# Altium schematic sheet base.SchDoc: base
size 495 x 337 mm; Date: 2019/11/11 19:09:25; SheetNumber: 1; GateName_1: G$2; SymbolName_1: DOCFIELD; LibraryName: frames; DeviceSetName: DINA3_L; Sheet: Sheet:; REV: REV:
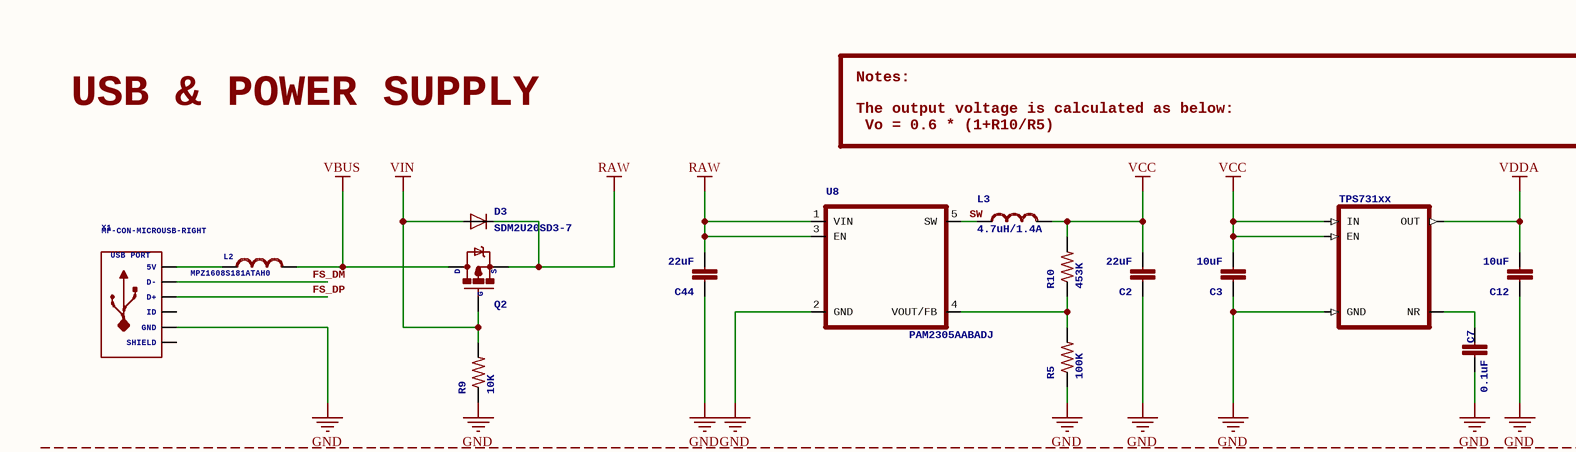
[diagram p0: base.SchDoc, top left]
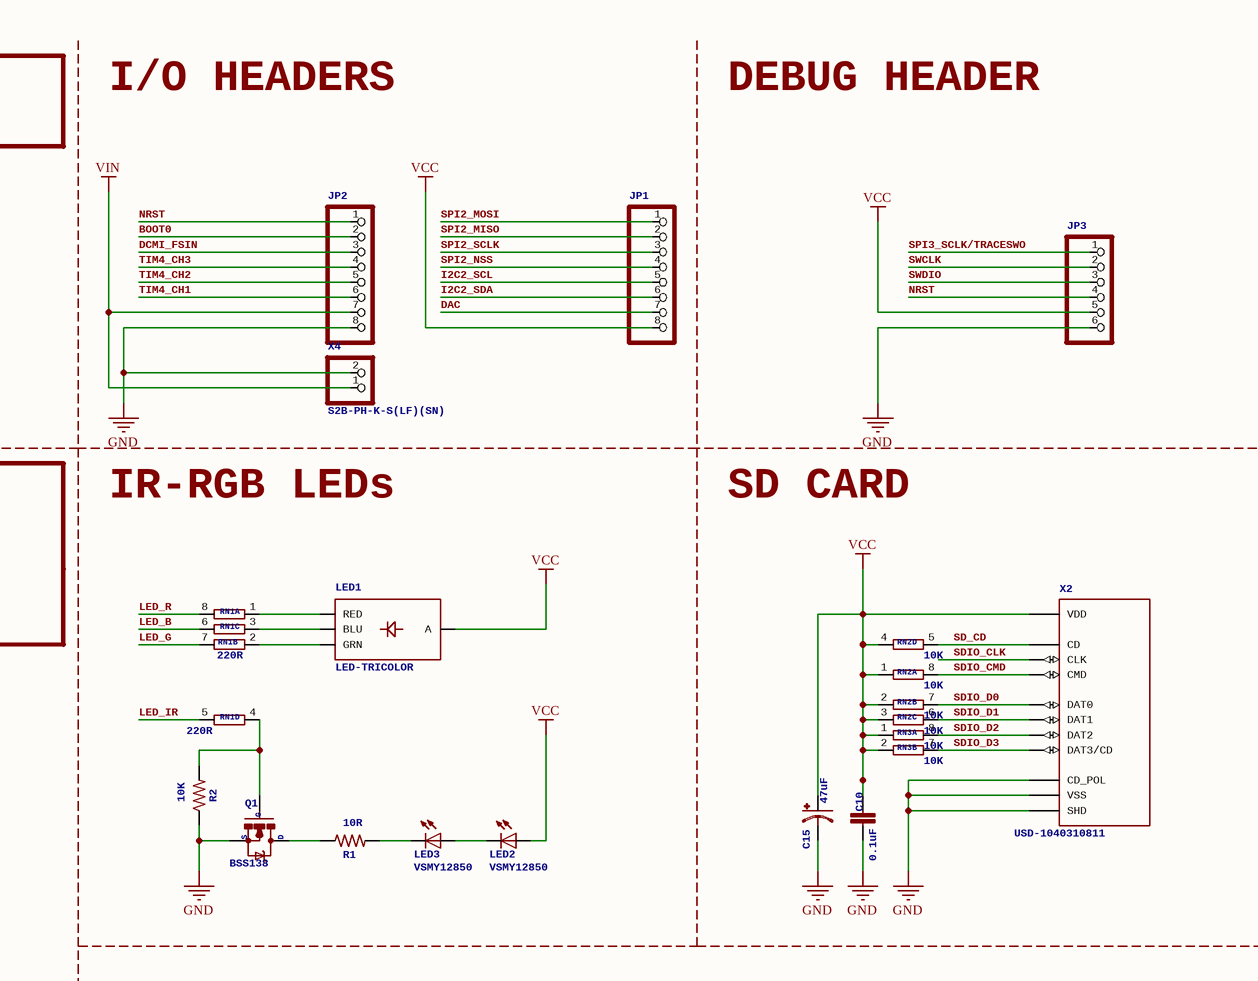
[diagram p1: base.SchDoc, top right]
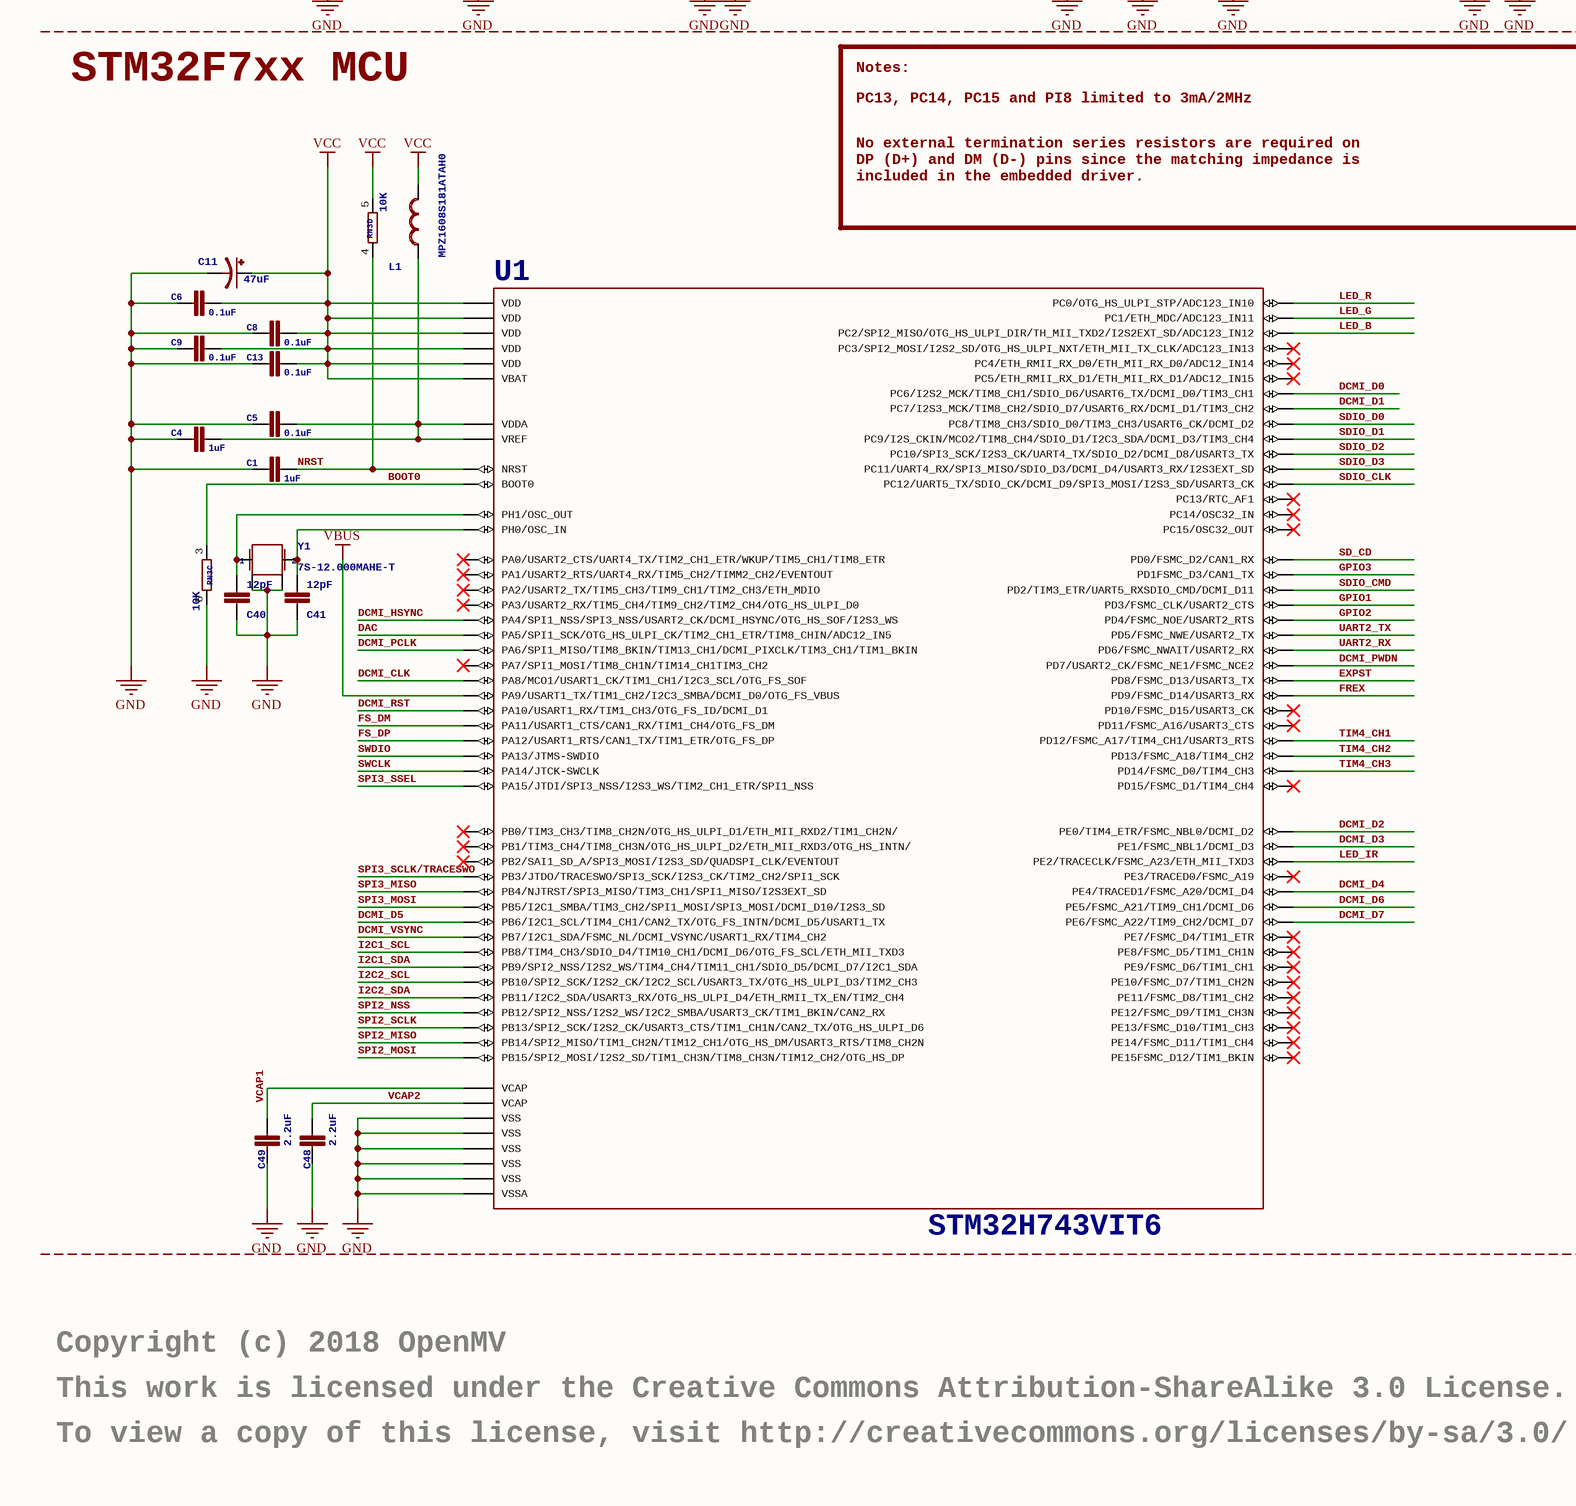
[diagram p2: base.SchDoc, bottom left]
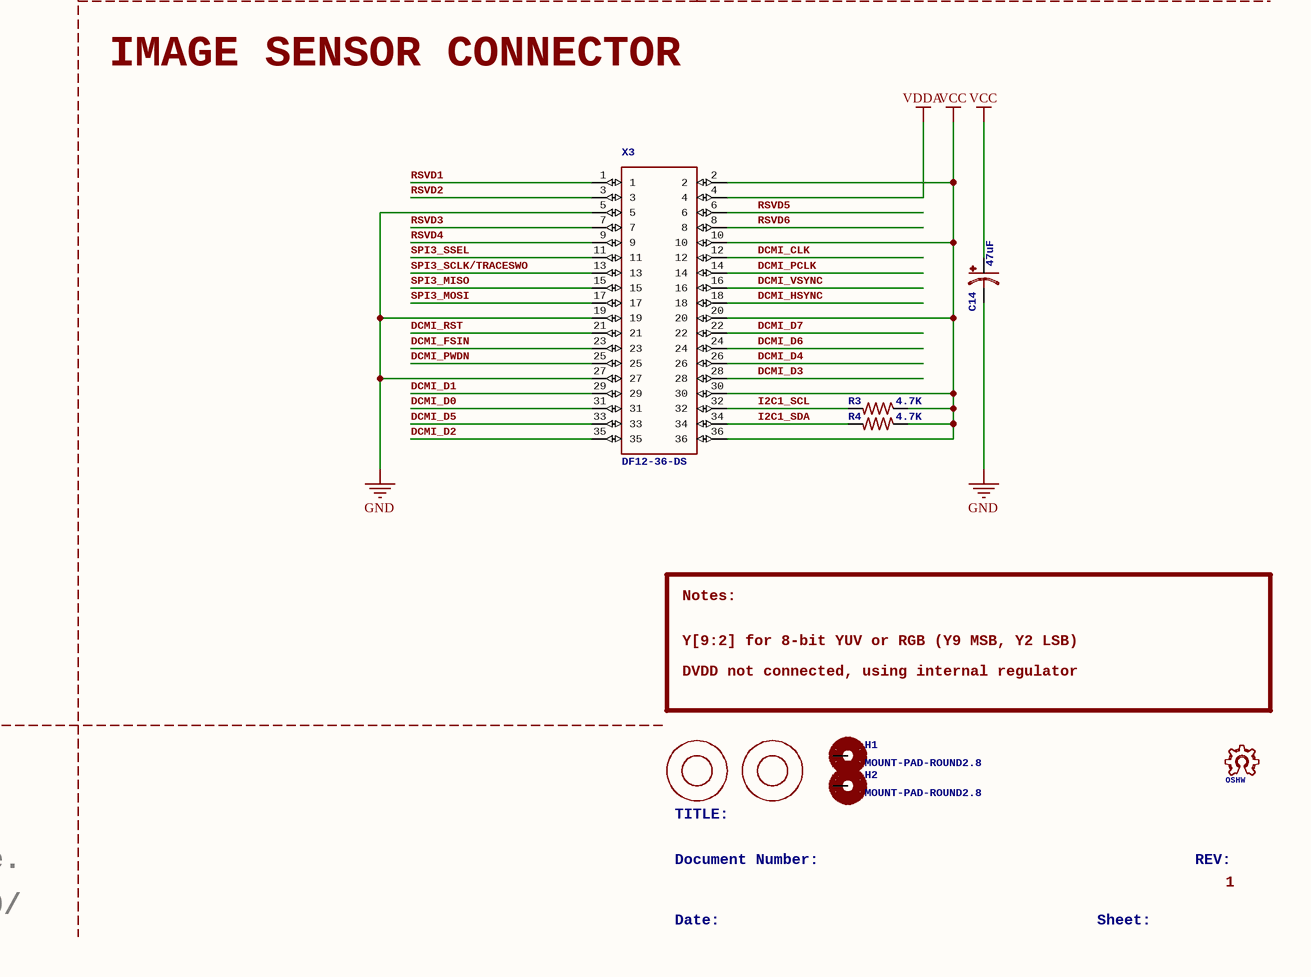
[diagram p3: base.SchDoc, bottom right]

## Parts
C1  1uF  [0603-CAP]
C2  22uF  [0805]
C3  10uF  [0805]
C4  1uF  [0603-CAP]
C5  0.1uF  [0603-CAP]
C6  0.1uF  [0603-CAP]
C7  0.1uF  [0603-CAP]
C8  0.1uF  [0603-CAP]
C9  0.1uF  [0603-CAP]
C10  0.1uF  [0603-CAP]
C11  47uF  [EIA3216]
C12  10uF  [0805]
C13  0.1uF  [0603-CAP]
C14  47uF  [EIA3216]
C15  47uF  [EIA3216]
C40  12pF  [0603-CAP]
C41  12pF  [0603-CAP]
C44  22uF  [0805]
C48  2.2uF  [0603-CAP]
C49  2.2uF  [0603-CAP]
D3  SDM2U20SD3-7  [SOD-323]
H1  MOUNT-PAD-ROUND2.8  [2,8-PAD]
H2  MOUNT-PAD-ROUND2.8  [2,8-PAD]
JP1  PINHD-1X8  [1X08]  (value not drawn)
JP2  PINHD-1X8  [1X08]  (value not drawn)
JP3  PINHD-1X6  [1X06]  (value not drawn)
L1  MPZ1608S181ATAH0  [0603]
L2  MPZ1608S181ATAH0  [0603]
L3  4.7uH/1.4A  [1007]
LED1  LED-TRICOLOR  [LED-TRICOLOR-SMD-MF]
LED2  VSMY12850  [LED-1206]
LED3  VSMY12850  [LED-1206]
LOGO1  OSHW_LOGO_FILLX0100-NT  [OSHW_FILLX100_NOTEXT]  (value not drawn)
M1  9774030243R  [9774030151R]  (value not drawn)
M2  9774030243R  [9774030151R]  (value not drawn)
Q1  BSS138  [SOT23-3]
Q2  Si2301BDS  [SOT23-3]  (value not drawn)
R1  10R  [0603-RES]
R2  10K  [0603-RES]
R3  4.7K  [0603-RES]
R4  4.7K  [0603-RES]
R5  100K  [0603-RES]
R9  10K  [0603-RES]
R10  453K  [0603-RES]
RN1  220R  [EXBV8V]  (value not drawn)  (parts A,B,C,D of 4)
RN2  10K  [EXBV8V]  (parts A,B,C,D of 4)
RN3  10K  [EXBV8V]  (parts A,B,C,D of 4)
U1  STM32H743VIT6  [LQFP100]
U5  TPS731XX  [SOT23-5]
U8  PAM2305AABADJ  [TSOT25]
X1  MF-CON-MICROUSB-RIGHT  USBPORT: USB PORT  [MICROUSB-RIGHT]
X2  USD-1040310811  [1040310811]
X3  DF12-36-DS  [DF12-36-DS]
X4  S2B-PH-K-S(LF)(SN)  [JST-PH-2-THM-RA]
Y1  7S-12.000MAHE-T  [CRYSTAL-2.5X2.0]

## Nets
GND: C1.2 C2.1 C3.1 C4.2 C5.2 C6.2 C7.2 C8.2 C9.2 C10.2 C11.C(-) C12.1 C13.2 C14.C(-) C15.C(-) C40.1 C41.1 C44.1 C48.2 C49.2 JP2.8 JP3.6 Q1.2(S) R2.1 R5.1 R9.1 RN3.6 U1.10(VSS) U1.19(VSSA) U1.26(VSS) U1.49(VSS) U1.74(VSS) U1.99(VSS) U5.2(GND) U8.2(GND) X1.5(GND) X2.CD$2(CD_POL) X2.G$1_G$2_G$3_G$4(SHD) X2.P$6(VSS) X3.5 X3.19 X3.27 X4.2 Y1.2(P$1) Y1.4(P$2)
RAW: C44.2 D3.1(C) Q2.2(S) U8.1(VIN) U8.3(EN)
VBUS: L2.2 Q2.3(D) U1.68(PA9/USART1_TX/TIM1_CH2/I2C3_SMBA/DCMI_D0/OTG_FS_VBUS)
VCC: C2.2 C3.2 C6.1 C8.1 C9.1 C10.1 C11.A(+) C13.1 C14.A(+) C15.A(+) JP1.8 JP3.5 L1.2 L3.2 LED1.A LED2.A R3.1 R4.1 R10.2 RN2.1 RN2.2 RN2.3 RN2.4 RN3.1 RN3.2 RN3.5 U1.6(VBAT) U1.11(VDD) U1.27(VDD) U1.50(VDD) U1.75(VDD) U1.100(VDD) U5.1(IN) U5.3(EN) X2.P$4(VDD) X3.2 X3.10 X3.20 X3.30 X3.36
VDDA: C12.2 U5.5(OUT) X3.4
VIN: D3.2(A) JP2.7 Q2.1(G) R9.2 X4.1
BOOT0: JP2.2 RN3.3 U1.94(BOOT0)
DAC: JP1.7 U1.29(PA5/SPI1_SCK/OTG_HS_ULPI_CK/TIM2_CH1_ETR/TIM8_CHIN/ADC12_IN5)
DCMI_CLK: U1.67(PA8/MCO1/USART1_CK/TIM1_CH1/I2C3_SCL/OTG_FS_SOF) X3.12
DCMI_D0: U1.63(PC6/I2S2_MCK/TIM8_CH1/SDIO_D6/USART6_TX/DCMI_D0/TIM3_CH1) X3.31
DCMI_D1: U1.64(PC7/I2S3_MCK/TIM8_CH2/SDIO_D7/USART6_RX/DCMI_D1/TIM3_CH2) X3.29
DCMI_D2: U1.97(PE0/TIM4_ETR/FSMC_NBL0/DCMI_D2) X3.35
DCMI_D3: U1.98(PE1/FSMC_NBL1/DCMI_D3) X3.28
DCMI_D4: U1.3(PE4/TRACED1/FSMC_A20/DCMI_D4) X3.26
DCMI_D5: U1.92(PB6/I2C1_SCL/TIM4_CH1/CAN2_TX/OTG_FS_INTN/DCMI_D5/USART1_TX) X3.33
DCMI_D6: U1.4(PE5/FSMC_A21/TIM9_CH1/DCMI_D6) X3.24
DCMI_D7: U1.5(PE6/FSMC_A22/TIM9_CH2/DCMI_D7) X3.22
DCMI_FSIN: JP2.3 X3.23
DCMI_HSYNC: U1.28(PA4/SPI1_NSS/SPI3_NSS/USART2_CK/DCMI_HSYNC/OTG_HS_SOF/I2S3_WS) X3.18
DCMI_PCLK: U1.30(PA6/SPI1_MISO/TIM8_BKIN/TIM13_CH1/DCMI_PIXCLK/TIM3_CH1/TIM1_BKIN) X3.14
DCMI_PWDN: U1.88(PD7/USART2_CK/FSMC_NE1/FSMC_NCE2) X3.25
DCMI_RST: U1.69(PA10/USART1_RX/TIM1_CH3/OTG_FS_ID/DCMI_D1) X3.21
DCMI_VSYNC: U1.93(PB7/I2C1_SDA/FSMC_NL/DCMI_VSYNC/USART1_RX/TIM4_CH2) X3.16
EXPST: U1.55(PD8/FSMC_D13/USART3_TX)
FREX: U1.56(PD9/FSMC_D14/USART3_RX)
FS_DM: U1.70(PA11/USART1_CTS/CAN1_RX/TIM1_CH4/OTG_FS_DM) X1.2(D-)
FS_DP: U1.71(PA12/USART1_RTS/CAN1_TX/TIM1_ETR/OTG_FS_DP) X1.3(D+)
GPIO1: U1.84(PD3/FSMC_CLK/USART2_CTS)
GPIO2: U1.85(PD4/FSMC_NOE/USART2_RTS)
GPIO3: U1.82(PD1FSMC_D3/CAN1_TX)
I2C1_SCL: R3.2 U1.95(PB8/TIM4_CH3/SDIO_D4/TIM10_CH1/DCMI_D6/OTG_FS_SCL/ETH_MII_TXD3) X3.32
I2C1_SDA: R4.2 U1.96(PB9/SPI2_NSS/I2S2_WS/TIM4_CH4/TIM11_CH1/SDIO_D5/DCMI_D7/I2C1_SDA) X3.34
I2C2_SCL: JP1.5 U1.46(PB10/SPI2_SCK/I2S2_CK/I2C2_SCL/USART3_TX/OTG_HS_ULPI_D3/TIM2_CH3)
I2C2_SDA: JP1.6 U1.47(PB11/I2C2_SDA/USART3_RX/OTG_HS_ULPI_D4/ETH_RMII_TX_EN/TIM2_CH4)
LED_B: RN1.6 U1.17(PC2/SPI2_MISO/OTG_HS_ULPI_DIR/TH_MII_TXD2/I2S2EXT_SD/ADC123_IN12)
LED_G: RN1.7 U1.16(PC1/ETH_MDC/ADC123_IN11)
LED_IR: RN1.5 U1.1(PE2/TRACECLK/FSMC_A23/ETH_MII_TXD3)
LED_R: RN1.8 U1.15(PC0/OTG_HS_ULPI_STP/ADC123_IN10)
NRST: C1.1 JP2.1 JP3.4 RN3.4 U1.14(NRST)
RSVD1: X3.1
RSVD2: X3.3
RSVD3: X3.7
RSVD4: X3.9
RSVD5: X3.6
RSVD6: X3.8
SD_CD: RN2.5 U1.81(PD0/FSMC_D2/CAN1_RX) X2.CD$1(CD)
SDIO_CLK: U1.80(PC12/UART5_TX/SDIO_CK/DCMI_D9/SPI3_MOSI/I2S3_SD/USART3_CK) X2.P$5(CLK)
SDIO_CMD: RN2.8 U1.83(PD2/TIM3_ETR/UART5_RXSDIO_CMD/DCMI_D11) X2.P$3(CMD)
SDIO_D0: RN2.7 U1.65(PC8/TIM8_CH3/SDIO_D0/TIM3_CH3/USART6_CK/DCMI_D2) X2.P$7(DAT0)
SDIO_D1: RN2.6 U1.66(PC9/I2S_CKIN/MCO2/TIM8_CH4/SDIO_D1/I2C3_SDA/DCMI_D3/TIM3_CH4) X2.P$8(DAT1)
SDIO_D2: RN3.8 U1.78(PC10/SPI3_SCK/I2S3_CK/UART4_TX/SDIO_D2/DCMI_D8/USART3_TX) X2.P$1(DAT2)
SDIO_D3: RN3.7 U1.79(PC11/UART4_RX/SPI3_MISO/SDIO_D3/DCMI_D4/USART3_RX/I2S3EXT_SD) X2.P$2(DAT3/CD)
SPI2_MISO: JP1.2 U1.53(PB14/SPI2_MISO/TIM1_CH2N/TIM12_CH1/OTG_HS_DM/USART3_RTS/TIM8_CH2N)
SPI2_MOSI: JP1.1 U1.54(PB15/SPI2_MOSI/I2S2_SD/TIM1_CH3N/TIM8_CH3N/TIM12_CH2/OTG_HS_DP)
SPI2_NSS: JP1.4 U1.51(PB12/SPI2_NSS/I2S2_WS/I2C2_SMBA/USART3_CK/TIM1_BKIN/CAN2_RX)
SPI2_SCLK: JP1.3 U1.52(PB13/SPI2_SCK/I2S2_CK/USART3_CTS/TIM1_CH1N/CAN2_TX/OTG_HS_ULPI_D6)
SPI3_MISO: U1.90(PB4/NJTRST/SPI3_MISO/TIM3_CH1/SPI1_MISO/I2S3EXT_SD) X3.15
SPI3_MOSI: U1.91(PB5/I2C1_SMBA/TIM3_CH2/SPI1_MOSI/SPI3_MOSI/DCMI_D10/I2S3_SD) X3.17
SPI3_SCLK/TRACESWO: JP3.1 U1.89(PB3/JTDO/TRACESWO/SPI3_SCK/I2S3_CK/TIM2_CH2/SPI1_SCK) X3.13
SPI3_SSEL: U1.77(PA15/JTDI/SPI3_NSS/I2S3_WS/TIM2_CH1_ETR/SPI1_NSS) X3.11
SW: L3.1 U8.5(SW)
SWCLK: JP3.2 U1.76(PA14/JTCK-SWCLK)
SWDIO: JP3.3 U1.72(PA13/JTMS-SWDIO)
TIM4_CH1: JP2.6 U1.59(PD12/FSMC_A17/TIM4_CH1/USART3_RTS)
TIM4_CH2: JP2.5 U1.60(PD13/FSMC_A18/TIM4_CH2)
TIM4_CH3: JP2.4 U1.61(PD14/FSMC_D0/TIM4_CH3)
UART2_RX: U1.87(PD6/FSMC_NWAIT/USART2_RX)
UART2_TX: U1.86(PD5/FSMC_NWE/USART2_TX)
VCAP1: C49.1 U1.48(VCAP)
VCAP2: C48.1 U1.73(VCAP)
NetC4_1: C4.1 C5.1 L1.1 U1.20(VREF) U1.21(VDDA)
NetC7_1: C7.1 U5.4(NR)
NetC40_2: C40.2 U1.13(PH1/OSC_OUT) Y1.3
NetC41_2: C41.2 U1.12(PH0/OSC_IN) Y1.1
NetL2_1: L2.1 X1.1(5V)
NetLED1_B: LED1.B(BLU) RN1.3
NetLED1_G: LED1.G(GRN) RN1.2
NetLED1_R: LED1.R(RED) RN1.1
NetLED2_C: LED2.C LED3.A
NetLED3_C: LED3.C R1.2
NetQ1_1: Q1.1(G) R2.2 RN1.4
NetQ1_3: Q1.3(D) R1.1
NetR5_2: R5.2 R10.1 U8.4(VOUT/FB)

Not connected (* = marked no-connect by the designer): H1 B2,8(MOUNT); H2 B2,8(MOUNT); U1 2(PE3/TRACED0/FSMC_A19)* 7(PC13/RTC_AF1)* 8(PC14/OSC32_IN)* 9(PC15/OSC32_OUT)* 18(PC3/SPI2_MOSI/I2S2_SD/OTG_HS_ULPI_NXT/ETH_MII_TX_CLK/ADC123_IN13)* 22(PA0/USART2_CTS/UART4_TX/TIM2_CH1_ETR/WKUP/TIM5_CH1/TIM8_ETR)* 23(PA1/USART2_RTS/UART4_RX/TIM5_CH2/TIMM2_CH2/EVENTOUT)* 24(PA2/USART2_TX/TIM5_CH3/TIM9_CH1/TIM2_CH3/ETH_MDIO)* 25(PA3/USART2_RX/TIM5_CH4/TIM9_CH2/TIM2_CH4/OTG_HS_ULPI_D0)* 31(PA7/SPI1_MOSI/TIM8_CH1N/TIM14_CH1TIM3_CH2)* 32(PC4/ETH_RMII_RX_D0/ETH_MII_RX_D0/ADC12_IN14)* 33(PC5/ETH_RMII_RX_D1/ETH_MII_RX_D1/ADC12_IN15)* 34(PB0/TIM3_CH3/TIM8_CH2N/OTG_HS_ULPI_D1/ETH_MII_RXD2/TIM1_CH2N/)* 35(PB1/TIM3_CH4/TIM8_CH3N/OTG_HS_ULPI_D2/ETH_MII_RXD3/OTG_HS_INTN/)* 36(PB2/SAI1_SD_A/SPI3_MOSI/I2S3_SD/QUADSPI_CLK/EVENTOUT)* 37(PE7/FSMC_D4/TIM1_ETR)* 38(PE8/FSMC_D5/TIM1_CH1N)* 39(PE9/FSMC_D6/TIM1_CH1)* 40(PE10/FSMC_D7/TIM1_CH2N)* 41(PE11/FSMC_D8/TIM1_CH2)* 42(PE12/FSMC_D9/TIM1_CH3N)* 43(PE13/FSMC_D10/TIM1_CH3)* 44(PE14/FSMC_D11/TIM1_CH4)* 45(PE15FSMC_D12/TIM1_BKIN)* 57(PD10/FSMC_D15/USART3_CK)* 58(PD11/FSMC_A16/USART3_CTS)* 62(PD15/FSMC_D1/TIM4_CH4)*; X1 4(ID) S1 S2 S3 S4 S5 S6(SLD)

## Notes on the sheet
- Notes:
- I/O HEADERS
- DEBUG HEADER
- USB & POWER SUPPLY
- The output voltage is calculated as below:
  Vo = 0.6 * (1+R10/R5)
- STM32F7xx MCU
- PC13, PC14, PC15 and PI8 limited to 3mA/2MHz
- IR-RGB LEDs
- SD CARD
- No external termination series resistors are required on
  DP (D+) and DM (D-) pins since the matching impedance is
  included in the embedded driver.
- IMAGE SENSOR CONNECTOR
- Y[9:2] for 8-bit YUV or RGB (Y9 MSB, Y2 LSB)
- DVDD not connected, using internal regulator
- (near M2) TITLE:
- Copyright (c) 2018 OpenMV
- This work is licensed under the Creative Commons Attribution-ShareAlike 3.0 License.
- Document Number:
- REV:
- 1
- To view a copy of this license, visit http://creativecommons.org/licenses/by-sa/3.0/
- Date:
- Sheet:

## Library data of the parts
C1 C4-C10 C13 C40 C41 C48 C49 = CAP0603-CAP: CapacitorStandard 0603 ceramic capacitor, and 0.1" leaded capacitor.; GateName_1: G$1; SymbolName_1: CAP; DeviceName: 0603-CAP; LibraryName: sfe; DeviceSetName: CAP
C2 C3 C12 C44 = CAP0805: CapacitorStandard 0603 ceramic capacitor, and 0.1" leaded capacitor.; GateName_1: G$1; SymbolName_1: CAP; DeviceName: 0805; LibraryName: sfe; DeviceSetName: CAP
C11 C14 C15 = CAP_POL1206: Capacitor PolarizedThese are standard SMD and PTH capacitors. Normally 10uF, 47uF, and 100uF in electrolytic and tantalum varieties. Always verify the external diameter of the through hole cap, it varies with capacity, voltage, and manufacturer. The EIA devices should be standard.; GateName_1: G$1; DeviceName: 1206; SymbolName_1: CAP_POL; LibraryName: sfe; DeviceSetName: CAP_POL
D3 = DIODESOD: DiodeThese are standard reverse protection diodes and small signal diodes. SMA package can handle up to about 1A. SOD-323 can handle about 200mA. What the SOD-323 package when ordering, there are some mfgs out there that are 5-pin packages.; GateName_1: G$1; SymbolName_1: DIODE; DeviceName: SOD; LibraryName: sfe; DeviceSetName: DIODE
H1 H2 = MOUNT-PAD-ROUND2.8: MOUNTING PAD, round; GateName_1: G$1; DeviceName: 2.8; SymbolName_1: MOUNT-PAD; LibraryName: holes; DeviceSetName: MOUNT-PAD-ROUND
JP1 JP2 = PINHD-1X8: PIN HEADER; GateName_1: A; SymbolName_1: PINHD8; LibraryName: pinhead; DeviceSetName: PINHD-1X8
JP3 = PINHD-1X6: PIN HEADER; GateName_1: A; SymbolName_1: PINHD6; LibraryName: pinhead; DeviceSetName: PINHD-1X6
L1 L2 = INDUCTOR0603: InductorsBasic Inductor/Choke - 0603 and 1206. Footprints are not proven and vary greatly between part numbers.; GateName_1: G$1; SymbolName_1: INDUCTOR; DeviceName: 0603; LibraryName: sfe; DeviceSetName: INDUCTOR
L3 = INDUCTOR1007: InductorsBasic Inductor/Choke - 0603 and 1206. Footprints are not proven and vary greatly between part numbers.; GateName_1: G$1; SymbolName_1: INDUCTOR; DeviceName: 1007; LibraryName: sfe; DeviceSetName: INDUCTOR
LED1 = LED-TRICOLOR: Tri-Color LED SMDProven layout and schematic for triple color LED in SMD package - common anode. Spark Fun Electronics SKU : COM-07844; GateName_1: G$1; SymbolName_1: LED-TRICOLORSMD; LibraryName: sfe; DeviceSetName: LED-TRICOLOR
LED2 LED3 = LED1206: LEDsStandard schematic elements and footprints for 5mm, 3mm, 1206, and 0603 sized LEDs. 5mm - Spark Fun Electronics SKU : COM-00529 (and others); GateName_1: G$1; SymbolName_1: LED; DeviceName: 1206; LibraryName: sfe; DeviceSetName: LED
LOGO1 = OSHW_LOGO_FILLX0100-NT: GateName_1: G$1; SymbolName_1: OSHW_LOGO; DeviceName: X0100-NT; LibraryName: iofault; DeviceSetName: OSHW_LOGO_FILL; OSHW: OSHW
M1 M2 = 9774030151R: GateName_1: G$1; SymbolName_1: STANDOFFS; LibraryName: STANDOFFS; DeviceSetName: 9774030151R
Q1 = MOSFET-NCHANNELSMD: GateName_1: G$1; DeviceName: SMD; SymbolName_1: MOSFET-NCHANNEL; LibraryName: sfe; DeviceSetName: MOSFET-NCHANNEL; D: D; S: S; G: G
Q2 = MOSFET-PCHANNELSMD: GateName_1: G$1; DeviceName: SMD; SymbolName_1: MOSFET-PCHANNEL; LibraryName: sfe; DeviceSetName: MOSFET-PCHANNEL; D: D; S: S; G: G
R1-R5 R9 R10 = RESISTOR0603-RES: ResistorBasic schematic elements and footprints for 0603, 1206, and PTH resistors.; GateName_1: G$1; SymbolName_1: RESISTOR; DeviceName: 0603-RES; LibraryName: sfe; DeviceSetName: RESISTOR
RN1-RN3 = 4R-NEXBV8V: Array Chip Resistor   Source: RS Component / Phycomp; GateName_1: A; SymbolName_1: R1NV; GateName_2: B; GateName_3: C; GateName_4: D; DeviceSetName: 4R-N; SymbolName_2: R1NV; SymbolName_3: R1NV; SymbolName_4: R1NV; DeviceName: EXBV8V; LibraryName: resistor-dil; MF: *; MPN: *; OC_FARNELL: unknown; OC_NEWARK: unknown
U1 = STM32F746LQFP100: GateName_1: G$1; SymbolName_1: STM32F746; DeviceName: LQFP100; LibraryName: stm32; DeviceSetName: STM32F746
U5 = TPS731XX: GateName_1: G$1; SymbolName_1: TPS731XX; LibraryName: mux; DeviceSetName: TPS731XX; TPS731xx: TPS731xx
U8 = PAM2305AAB330: GateName_1: G$1; SymbolName_1: PAM2305; LibraryName: regulators; DeviceSetName: PAM2305AAB330
X1 = USB_MICRO_RIGHT: Library:  MF_Connectors Description: 5 Pin USB Connectors. SLD is the shield connection. Usually tied to ground through a small ferrite bead.; GateName_1: G$1; SymbolName_1: USB_5PIN; DeviceName: _MICRO_RIGHT; LibraryName: MF_Connectors; DeviceSetName: USB; 5V: 5V; D-: D-; D+: D+; ID: ID; GND: GND; SHIELD: SHIELD
X2 = USD-1040310811: GateName_1: G$1; SymbolName_1: USD; LibraryName: molex; DeviceSetName: USD-1040310811
X3 = DF12-36-DS: GateName_1: G$1; SymbolName_1: DF12-36; LibraryName: DF12; DeviceSetName: DF12-36-DS
X4 = JST_2PIN-THM-RA: JST 2-Pin Connectors of various flavors SMT-RA (S2B-PH-SM4) 4UConnector #17311  SMT  (B2B-PH-SM4)  THM-RA (S2B-PH)  THM  (B2B-PH); GateName_1: G$1; SymbolName_1: PINHD2; DeviceName: -THM-RA; LibraryName: adafruit-updated; DeviceSetName: JST_2PIN
Y1 = CRYSTAL2.5X2.0: CrystalsVarious standard crystals. Proven footprints. Spark Fun Electronics SKU : COM-00534; GateName_1: G$1; SymbolName_1: Q; DeviceName: 2.5X2.0; LibraryName: mux; DeviceSetName: CRYSTAL; 1: 1; 2: 2